# EAGLE design vhf-radio (EAGLE 6.3)
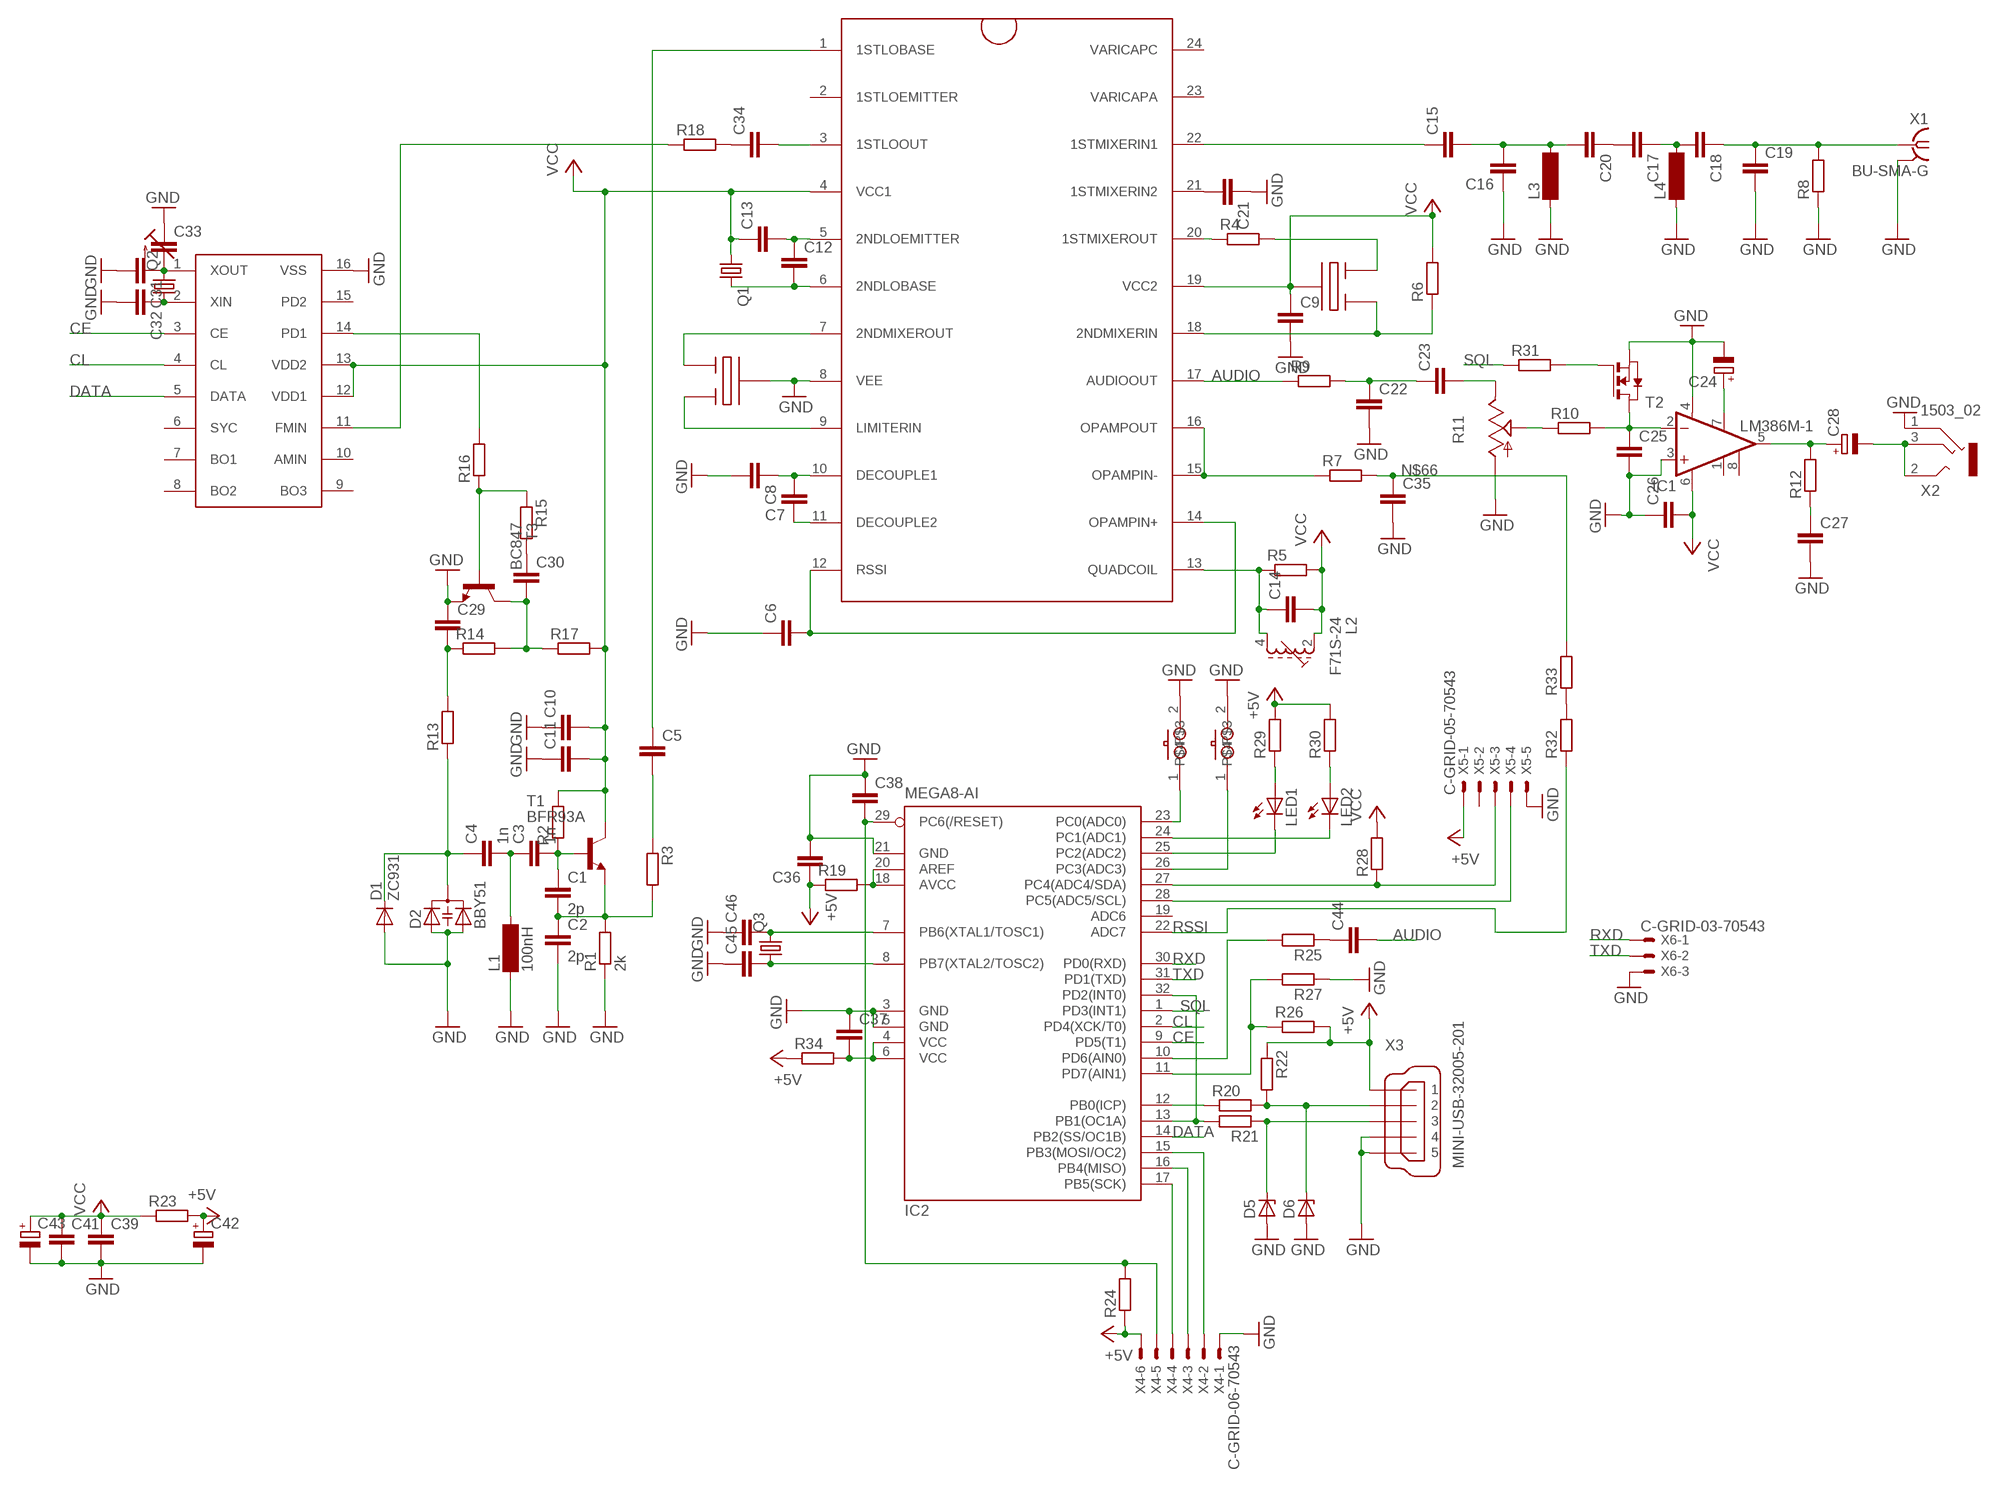
[diagram p0: schematic, sheet 1]

## Parts
C1  2p  C-EUC0805  [C0805]
C2  2p  C-EUC0805  [C0805]
C3  1n  C-EUC0805  [C0805]
C4  1n  C-EUC0805  [C0805]
C5  C-EUC0805  [C0805]
C6  C-EUC0805  [C0805]
C7  C-EUC0805  [C0805]
C8  C-EUC0805  [C0805]
C9  C-EUC0805  [C0805]
C10  C-EUC0805  [C0805]
C11  C-EUC0805  [C0805]
C12  C-EUC0805  [C0805]
C13  C-EUC0805  [C0805]
C14  C-EUC0805  [C0805]
C15  C-EUC0805  [C0805]
C16  C-EUC0805  [C0805]
C17  C-EUC0805  [C0805]
C18  C-EUC0805  [C0805]
C19  C-EUC0805  [C0805]
C20  C-EUC0805  [C0805]
C21  C-EUC0805  [C0805]
C22  C-EUC0805  [C0805]
C23  C-EUC0805  [C0805]
C24  CPOL-EU153CLV-0505  [153CLV-0505]
C25  C-EUC0805  [C0805]
C26  C-EUC0805  [C0805]
C27  C-EUC0805  [C0805]
C28  CPOL-EU153CLV-0605  [153CLV-0605]
C29  C-EUC0805  [C0805]
C30  C-EUC0805  [C0805]
C31  C-EUC0805  [C0805]
C32  C-EUC0805  [C0805]
C33  C-TRIMM3018_12  [CTRIM3018_12]
C34  C-EUC0805  [C0805]
C35  C-EUC0805  [C0805]
C36  C-EUC0805  [C0805]
C37  C-EUC0805  [C0805]
C38  C-EU075-032X103  [C075-032X103]
C39  C-EUC0805  [C0805]
C41  C-EUC0805  [C0805]
C42  CPOL-EU175TMP-0808  [175TMP-0808]
C43  CPOL-EU175TMP-0808  [175TMP-0808]
C44  C-EUC0805  [C0805]
C45  C-EUC0805  [C0805]
C46  C-EUC0805  [C0805]
D1  ZC931  DIODE-MINIMELF  [MINIMELF]
D2  BBY51  [SOT23]
D5  ZENER-DIODESOD80C  [SOD80C]
D6  ZENER-DIODESOD80C  [SOD80C]
IC1  LM386M-1  [SO08]
IC2  MEGA8-AI  [TQFP32-08]
L1  100nH  SM-1206  [SM-1206]
L2  F71S-24  [71S]
L3  SM-1206  [SM-1206]
L4  SM-1206  [SM-1206]
LED1  LEDCHIPLED_0805  [CHIPLED_0805]
LED2  LEDCHIPLED_0805  [CHIPLED_0805]
Q1  CRYSTALHC49UP  [HC49UP]
Q2  CRYSTALHC49UP  [HC49UP]
Q3  CRYSTALHC49UP  [HC49UP]
R1  2k  R-EU_R0805  [R0805]
R2  R-EU_R0805  [R0805]
R3  R-EU_R0805  [R0805]
R4  R-EU_R0805  [R0805]
R5  R-EU_R0805  [R0805]
R6  R-EU_R0805  [R0805]
R7  R-EU_R0805  [R0805]
R8  R-EU_R0805  [R0805]
R9  R-EU_R0805  [R0805]
R10  R-EU_R0805  [R0805]
R11  TRIM_US-CIP20C-6MM  [CIP20C-6MM]
R12  R-EU_R0805  [R0805]
R13  R-EU_R0805  [R0805]
R14  R-EU_R0805  [R0805]
R15  R-EU_R0805  [R0805]
R16  R-EU_R0805  [R0805]
R17  R-EU_R0805  [R0805]
R18  R-EU_R0805  [R0805]
R19  R-EU_R0805  [R0805]
R20  R-EU_R0805  [R0805]
R21  R-EU_R0805  [R0805]
R22  R-EU_R0805  [R0805]
R23  R-EU_0207/10  [0207/10]
R24  R-EU_R0805  [R0805]
R25  R-EU_R0805  [R0805]
R26  R-EU_R0805  [R0805]
R27  R-EU_R0805  [R0805]
R28  R-EU_0207/10  [0207/10]
R29  R-EU_R0805  [R0805]
R30  R-EU_R0805  [R0805]
R31  R-EU_R1206  [R1206]
R32  R-EU_0207/10  [0207/10]
R33  R-EU_0207/10  [0207/10]
R34  R-EU_0207/10  [0207/10]
T1  BFR93A  BFR53-NPN-SOT23-BEC  [SOT23-BEC]
T2  NMOSSOT23  [SOT-23]
T3  BC847  [SOT23]
U$1  MC13135P-SMD  [DIP-SMD]
U$2  QFILTER  [SIP3-SMD]
U$3  QFILTER  [SIP3-SMD]
U$4  LM7001-DIPSMD  [DIP16-SMD]
U$5  TS-1  [TS-1]
U$6  TS-1  [TS-1]
X1  BU-SMA-G  [BU-SMA-G]
X2  1503_02  [1503_02]
X3  MINI-USB-32005-201  [32005-201]
X4  C-GRID-06-70543  [70543-06]
X5  C-GRID-05-70543  [70543-05]
X6  C-GRID-03-70543  [70543-03]

## Nets
+5V: C36.1 C42.+ R19.1 R22.1 R23.2 R24.1 R26.2 R29.2 R30.2 R34.1 X3.1 X4.6 X5.1
AUDIO: C44.2 R9.1 U$1.17(AUDIOOUT)
CE: IC2.9(PD5(T1)) U$4.3(CE)
CL: IC2.2(PD4(XCK/T0)) U$4.4(CL)
DATA: IC2.14(PB2(SS/OC1B)) U$4.5(DATA)
GND: C2.2 C6.1 C8.2 C9.2 C10.1 C11.1 C16.1 C19.2 C21.1 C22.2 C24.- C25.2 C26.1 C27.2 C29.1 C31.2 C32.2 C33.+(E) C35.2 C36.2 C37.1 C38.1 C39.2 C41.2 C42.- C43.- C45.1 C46.1 D1.A D2.1(A1) D2.2(A2) D5.A D6.A IC1.3(+IN) IC1.4(GND) IC2.3(GND) IC2.5(GND) IC2.21(GND) L1.1 L3.1 L4.1 R1.1 R8.1 R11.A R27.1 T2.2(S) T3.2(E) U$1.8(VEE) U$2.P$2 U$4.16(VSS) U$5.2 U$6.2 X1.2(GND) X2.1 X3.4 X3.5 X4.1 X5.5 X6.3
N$1: C1.2 C2.1 R1.2 R3.2 T1.E
N$2: C1.1 C3.2 R2.1 T1.B
N$3: C5.2 R3.1
N$4: C3.1 C4.2 L1.2
N$5: R16.2 U$4.14(PD1)
N$6: C5.1 U$1.1(1STLOBASE)
N$7: C6.2 U$1.12(RSSI) U$1.14(OPAMPIN+)
N$8: U$1.7(2NDMIXEROUT) U$2.P$1
N$9: U$1.9(LIMITERIN) U$2.P$3
N$10: C14.1 L2.4(E) R5.1 U$1.13(QUADCOIL)
N$11: C12.2 Q1.2 U$1.6(2NDLOBASE)
N$12: R4.1 U$1.20(1STMIXEROUT)
N$13: R4.2 U$3.P$3
N$14: R6.1 U$1.18(2NDMIXERIN) U$3.P$1
N$15: C12.1 C13.2 U$1.5(2NDLOEMITTER)
N$16: C15.2 C16.2 C20.2 L3.2
N$17: C7.1 U$1.11(DECOUPLE2)
N$18: C7.2 C8.1 U$1.10(DECOUPLE1)
N$19: R7.1 U$1.15(OPAMPIN-) U$1.16(OPAMPOUT)
N$20: C21.2 U$1.21(1STMIXERIN2)
N$21: C15.1 U$1.22(1STMIXERIN1)
N$22: C45.2 IC2.8(PB7(XTAL2/TOSC2)) Q3.1
N$23: C17.2 C20.1
N$24: C17.1 C18.2 L4.2
N$25: C18.1 C19.1 R8.2 X1.1
N$26: C22.1 C23.1 R9.2
N$27: C23.2 R11.E
N$28: R10.1 R11.S
N$29: C25.1 IC1.2(-IN) R10.2 T2.1(D)
N$30: C24.+ IC1.7(BYPASS)
N$31: C29.2 R13.2 R14.1
N$32: C27.1 R12.1
N$33: C28.+ IC1.5(OUT) R12.2
N$34: C28.- X2.2 X2.3
N$35: C30.2 R14.2 R17.1 T3.3(C)
N$36: R15.1 R16.1 T3.1(B)
N$37: C30.1 R15.2
N$38: C31.1 C33.-(A) Q2.2 U$4.1(XOUT)
N$39: IC2.18(AVCC) IC2.20(AREF) R19.2
N$40: C32.1 Q2.1 U$4.2(XIN)
N$41: C34.1 R18.2
N$42: C34.2 U$1.3(1STLOOUT)
N$43: R18.1 U$4.11(FMIN)
N$44: C4.1 D1.C D2.3(C) R13.1
N$45: IC2.13(PB1(OC1A)) IC2.32(PD2(INT0)) R21.2
N$46: IC2.12(PB0(ICP)) R20.1
N$47: D6.C R20.2 R22.2 X3.2
N$48: D5.C R21.1 X3.3
N$49: IC2.15(PB3(MOSI/OC2)) X4.2
N$50: IC2.16(PB4(MISO)) X4.3
N$51: IC2.17(PB5(SCK)) X4.4
N$52: C38.2 IC2.29(PC6(/RESET)) R24.2 X4.5
N$53: C44.1 R25.1
N$54: IC2.10(PD6(AIN0)) R25.2
N$55: IC2.11(PD7(AIN1)) R26.1 R27.2
N$56: C46.2 IC2.7(PB6(XTAL1/TOSC1)) Q3.2
N$57: IC2.27(PC4(ADC4/SDA)) R28.1 X5.3
N$58: IC2.28(PC5(ADC5/SCL)) X5.4
N$59: IC2.25(PC2(ADC2)) LED1.C
N$60: IC2.24(PC1(ADC1)) LED2.C
N$61: LED1.A R29.1
N$62: LED2.A R30.1
N$63: IC2.23(PC0(ADC0)) U$5.1
N$64: IC2.26(PC3(ADC3)) U$6.1
N$65: R31.2 T2.3(G)
N$66: C35.1 R7.2 R33.2
N$67: R32.2 R33.1
N$68: C37.2 IC2.4(VCC) IC2.6(VCC) R34.2
RSSI: IC2.22(ADC7) R32.1
RXD: IC2.30(PD0(RXD)) X6.1
SQL: IC2.1(PD3(INT1)) R31.1
TXD: IC2.31(PD1(TXD)) X6.2
VCC: C9.1 C10.2 C11.2 C13.1 C14.2 C26.2 C39.1 C41.1 C43.+ IC1.6(VS) L2.2(A) Q1.1 R2.2 R5.2 R6.2 R17.2 R23.1 R28.2 T1.C U$1.4(VCC1) U$1.19(VCC2) U$3.P$2 U$4.12(VDD1) U$4.13(VDD2)
Unconnected: IC1.1(GAIN) IC1.8(GAIN) IC2.19(ADC6) L2.S1 L2.S2 U$1.2(1STLOEMITTER) U$1.23(VARICAPA) U$1.24(VARICAPC) U$4.6(SYC) U$4.7(BO1) U$4.8(BO2) U$4.9(BO3) U$4.10(AMIN) U$4.15(PD2) X2.2@2 X5.2

## Power pins joined to a net without a drawn wire
GND: X1.3(GND) X1.4(GND) X1.5(GND)

## Library data of the parts
C1-C4 C12 C13 C15-C23 = resistor:C-EU: CAPACITOR, European symbol
C5-C11 C14 C25-C27 C29-C32 C34-C39 C41 C44-C46 = rcl:C-EU: CAPACITOR, European symbol
C24 C42 C43 = rcl:CPOL-EU: POLARIZED CAPACITOR, European symbol
C28 = resistor:CPOL-EU: POLARIZED CAPACITOR, European symbol
C33 = rcl:C-TRIMM: Trimm capacitor
D1 = diode:DIODE-: DIODE
D2 = diode:BBY51: Capacity DIODE variable-capacitance diode (Infineon)
D5 D6 = diode:ZENER-DIODE: Z-Diode
IC1 = linear:LM386?-*: Low Voltage Audio Power Amplifier Source: http://cache.national.com/ds/LM/LM386.pdf
IC2 = atmel:MEGA8: MICROCONTROLLER 8 Kbytes FLASH, 1 kbytes SRAM, 512 bytes EEPROM, USART, 6-channel 10 bit ADC, 2-channel 8 bit ADC Pin compatible with Atmega48, ATMega88, ATMega168 Source: avr.lbr
L1 L3 L4 = inductor-neosid:SM-1206: INDUCTOR SMD chip inductor
L2 = inductor-neosid:F71S-: FILTER pre-adjusted filter coil, type S
LED1 LED2 = led:LED: LED OSRAM: - CHIPLED LG R971, LG N971, LY N971, LG Q971, LY Q971, LO R971, LY R971 LH N974, LH R974 LS Q976, LO Q976, LY Q976 LO Q996 - Hyper CHIPLED LW Q18S LB Q993, LB Q99A, LB R99A - SideLED LS A670, LO A670, LY A670, LG A670, LP A670 LB A673, LV A673, LT A673, LW A673 LH A674 LY A675 LS A676, LA A676, LO A676, LY A676, LW A676 LS A679, LY A679, LG A679 - Hyper Micro SIDELED® LS Y876, LA Y876, LO Y876, LY Y876 LT Y87S - SmartLED LW L88C, LW L88S LB L89C, LB L89S, LG L890 LS L89K, LO L89K, LY L89K LS L896, LA L896, LO L896, LY L896 - TOPLED LS T670, LO T670, LY T670, LG T670, LP T670 LSG T670, LSP T670, LSY T670, LOP T670, LYG T670 LG T671, LOG T671, LSG T671 LB T673, LV T673, LT T673, LW T673 LH T674 LS T676, LA T676, LO T676, LY T676, LB T676, LH T676, LSB T676, LW T676 LB T67C, LV T67C, LT T67C, LS T67K, LO T67K, LY T67K, LW E67C LS E67B, LA E67B, LO E67B, LY E67B, LB E67C, LV E67C, LT E67C LW T67C LS T679, LY T679, LG T679 LS T770, LO T770, LY T770, LG T770, LP T770 LB T773, LV T773, LT T773, LW T773 LH T774 LS E675, LA E675, LY E675, LS T675 LS T776, LA T776, LO T776, LY T776, LB T776 LHGB T686 LT T68C, LB T68C - Hyper Mini TOPLED® LB M676 - Mini TOPLED Santana® LG M470 LS M47K, LO M47K, LY M47K Source: http://www.osram.convergy.de LUXEON: - LUMILED® LXK2-PW12-R00, LXK2-PW12-S00, LXK2-PW14-U00, LXK2-PW14-V00 LXK2-PM12-R00, LXK2-PM12-S00, LXK2-PM14-U00 LXK2-PE12-Q00, LXK2-PE12-R00, LXK2-PE12-S00, LXK2-PE14-T00, LXK2-PE14-U00 LXK2-PB12-K00, LXK2-PB12-L00, LXK2-PB12-M00, LXK2-PB14-N00, LXK2-PB14-P00, LXK2-PB14-Q00 LXK2-PR12-L00, LXK2-PR12-M00, LXK2-PR14-Q00, LXK2-PR14-R00 LXK2-PD12-Q00, LXK2-PD12-R00, LXK2-PD12-S00 LXK2-PH12-R00, LXK2-PH12-S00 LXK2-PL12-P00, LXK2-PL12-Q00, LXK2-PL12-R00 Source: www.luxeon.com KINGBRIGHT: KA-3528ASYC Source: www.kingbright.com
Q1-Q3 = crystal:CRYSTAL: CRYSTAL
R1 R2 R8 R23 R28 R32-R34 = resistor:R-EU_: RESISTOR, European symbol
R3-R7 R9 R10 R12-R22 R24-R27 R29-R31 = rcl:R-EU_: RESISTOR, European symbol
R11 = pot:TRIM_US-: POTENTIOMETER
T1 = transistor:*-NPN-: NPN Transistror BF959 corrected 2008.03.06
T2 = zetex:NMOSSOT23: MOS FET
T3 = transistor:BC847: NPN TRANSISTOR
U$1 = radio:MC13135P-SMD
U$2 U$3 = radio:QFILTER
U$4 = radio:LM7001-DIPSMD
U$5 U$6 = radio:TS-1
X1 = con-coax:BU-SMA-G: FEMALE SMA CONNECTOR Radiall distributor RS 193-9117
X2 = con-lumberg:1503_02: Jack connectors according to JISC 6560, 3.5 mm Klinkeneinbaukupplung nach JISC 6560, 3,5 mm, 3-polig/stereo, abgewinkelte Ausführung, Surface-Mount-Technik (SMT) Source: http://www.lumberg.com/Produkte/PDFs/1503_02.pdf
X3 = con-cypressindustries:MINI-USB-: MINI USB-B Conector Source: www.cypressindustries.com
X4 = con-molex:C-GRID-06: CONNECTOR wire to board 2.54 mm (0.100") pitch header
X5 = con-molex:C-GRID-05: CONNECTOR wire to board 2.54 mm (0.100") pitch header
X6 = con-molex:C-GRID-03: CONNECTOR wire to board 2.54 mm (0.100") pitch header

## Board
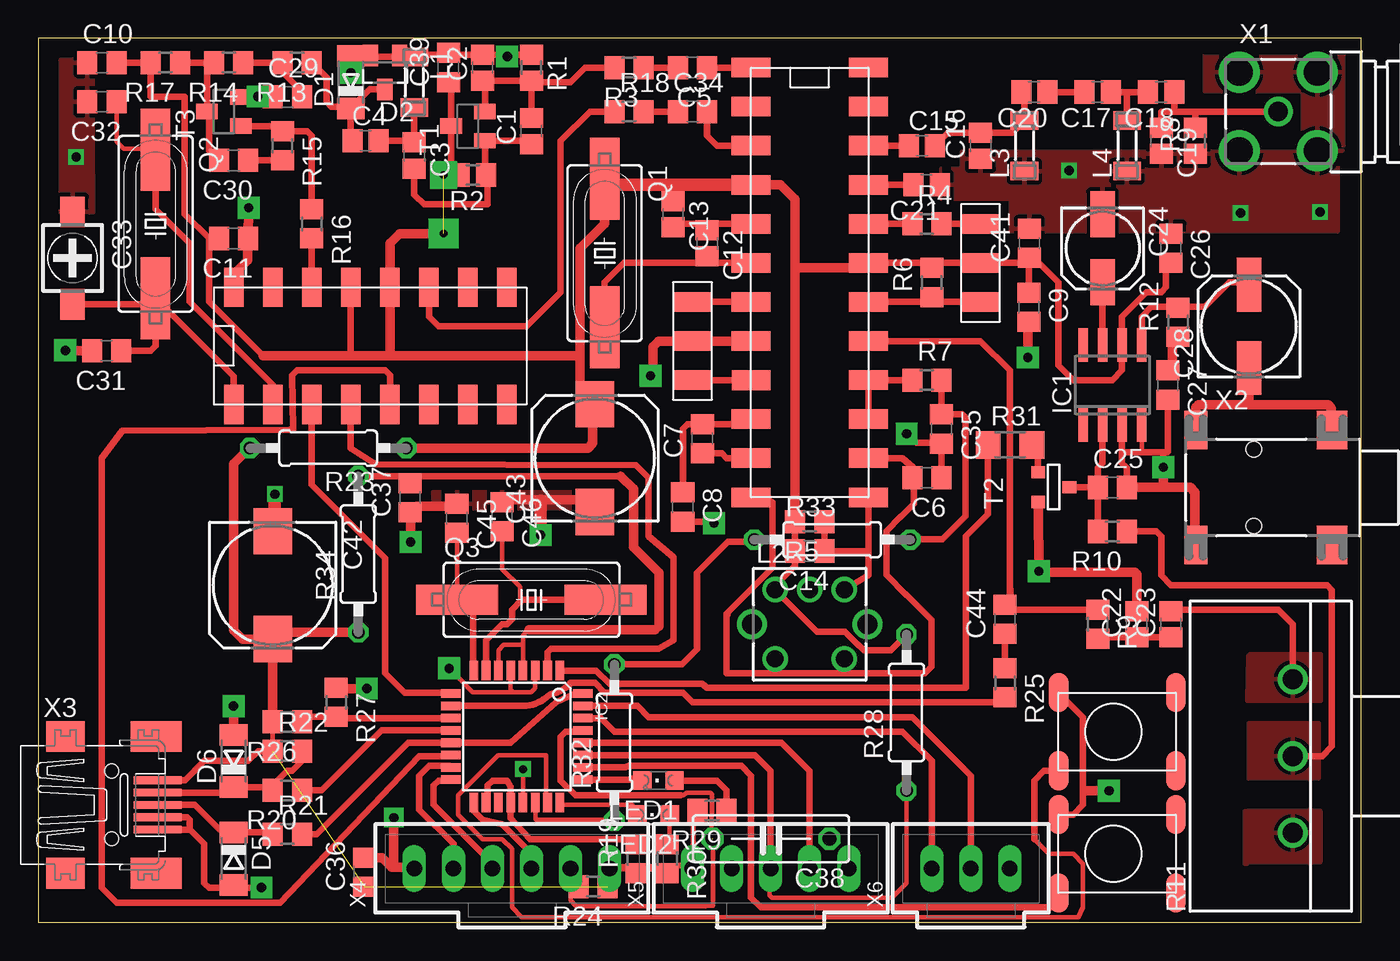
[diagram p1: board, top side]
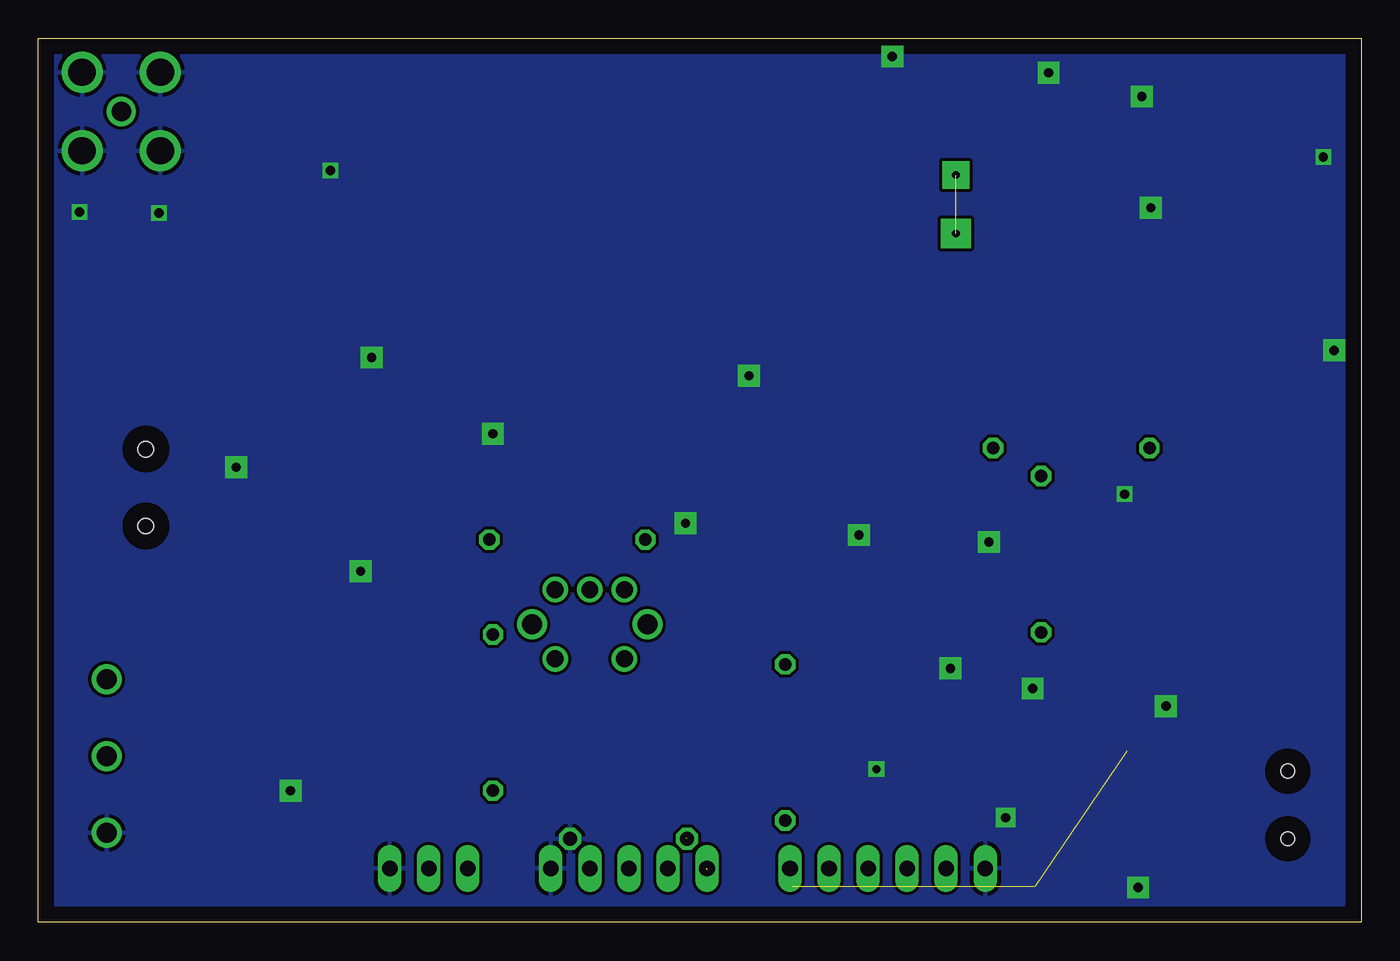
[diagram p2: board, bottom side, seen from below]

Size 86.03 x 57.46 mm. Coordinates in mm from the lower left corner, seen from the top.
Outline: 0,0 86.03,0 86.03,57.46 0,57.46 0,0
Copper layers (1*16): Top 0.035mm / dielectric 1.5mm / Bottom 0.035mm
Design rules "default": minimum track width 10mil, minimum drill 24mil, track to track 8mil, track to pad 8mil, pad to pad 8mil, via to via 8mil, smd to smd 8mil, copper to edge 40mil, drill to drill 8mil, minimum pad ring 10mil, minimum via ring 8mil, stop-mask expansion 4mil, vias tented up to drill 0mil, thermal gap 10mil

### Footprints (pad centres in the part's own frame; a part is rotated, then mirrored left to right if it is on the bottom)
C0805 = smd 1.3 x 1.5: 1 -0.85,0; 2 0.85,0
C0805' = smd 1.3 x 1.5: 1 -0.95,0; 2 0.95,0
153CLV-0505 = smd 3 x 1.6: + 2.2,0; - -2.2,0
153CLV-0605 = smd 3.5 x 1.6: + 2.7,0; - -2.7,0
CTRIM3018_12 = smd 2 x 1.6: + -3,0; - 3,0
C075-032X103 = drill 0.914 octagon: 1 -3.81,0; 2 3.81,0
175TMP-0808 = smd 3 x 2.5: + 3.5,0; - -3.5,0
MINIMELF = smd 1.4 x 1.8: A 1.7,0; C -1.7,0
SOT23 = smd 1 x 1.4: 1 -0.95,-1.1; 2 0.95,-1.1; 3 0,1.1
SOD80C = smd 1.4 x 1.8: A 1.7,0; C -1.7,0
SO08 = smd 0.6 x 2.2: 1 -1.905,-2.6; 2 -0.635,-2.6; 3 0.635,-2.6; 4 1.905,-2.6; 5 1.905,2.6; 6 0.635,2.6; 7 -0.635,2.6; 8 -1.905,2.6
TQFP32-08 = smd 1.27 x 0.559: 1 -4.293,2.8; 2 -4.293,2; 3 -4.293,1.2; 4 -4.293,0.4; 5 -4.293,-0.4; 6 -4.293,-1.2; 7 -4.293,-2; 8 -4.293,-2.8; 17 4.293,-2.8; 18 4.293,-2; 19 4.293,-1.2; 20 4.293,-0.4; 21 4.293,0.4; 22 4.293,1.2; 23 4.293,2; 24 4.293,2.8 | smd 0.559 x 1.27: 9 -2.8,-4.293; 10 -2,-4.293; 11 -1.2,-4.293; 12 -0.4,-4.293; 13 0.4,-4.293; 14 1.2,-4.293; 15 2,-4.293; 16 2.8,-4.293; 25 2.8,4.293; 26 2,4.293; 27 1.2,4.293; 28 0.4,4.293; 29 -0.4,4.293; 30 -1.2,4.293; 31 -2,4.293; 32 -2.8,4.293
SM-1206 = smd 1.2 x 1.8: 1 -1.65,0; 2 1.65,0
71S = drill 1.1: 1 -2.25,-2.25; 2 -2.25,2.25; 3 0,2.25; 4 2.25,2.25; 5 2.25,-2.25 | drill 1.3: S1 -3.75,0; S2 3.75,0
CHIPLED_0805 = smd 1.2 x 1.2: A 0,-1.05; C 0,1.05
HC49UP = smd 5.334 x 1.93: 1 -4.826,0; 2 4.826,0
R0805 = smd 1.3 x 1.5: 1 -0.85,0; 2 0.85,0
R0805' = smd 1.3 x 1.5: 1 -0.95,0; 2 0.95,0
CIP20C-6MM = drill 1.3 pad 1.93: A -5,0; E 5,0; S 0,0
0207/10 = drill 0.813 octagon: 1 -5.08,0; 2 5.08,0
R1206 = smd 1.6 x 1.803: 1 -1.422,0; 2 1.422,0
SOT23-BEC = smd 1 x 1.4: B -0.95,-1.1; C 0,1.1; E 0.95,-1.1
SOT-23 = smd 0.787 x 0.889: 1 0.025,-1.016; 2 -0.94,1.016; 3 0.991,1.016
DIP-SMD = smd 2.54 x 1.27: 1 0,0; 2 0,-2.54; 3 0,-5.08; 4 0,-7.62; 5 0,-10.16; 6 0,-12.7; 7 0,-15.24; 8 0,-17.78; 9 0,-20.32; 10 0,-22.86; 11 0,-25.4; 12 0,-27.94; 13 7.62,-27.94; 14 7.62,-25.4; 15 7.62,-22.86; 16 7.62,-20.32; 17 7.62,-17.78; 18 7.62,-15.24; 19 7.62,-12.7; 20 7.62,-10.16; 21 7.62,-7.62; 22 7.62,-5.08; 23 7.62,-2.54; 24 7.62,0
SIP3-SMD = smd 2.54 x 1.27: P$1 0,1.27; P$2 0,-1.27; P$3 0,-3.81
DIP16-SMD = smd 2.54 x 1.27: 1 0,0; 2 0,-2.54; 3 0,-5.08; 4 0,-7.62; 5 0,-10.16; 6 0,-12.7; 7 0,-15.24; 8 0,-17.78; 9 7.62,-17.78; 10 7.62,-15.24; 11 7.62,-12.7; 12 7.62,-10.16; 13 7.62,-7.62; 14 7.62,-5.08; 15 7.62,-2.54; 16 7.62,0
TS-1 = smd 2.54 x 1.27: 1 0,0; 2 5.08,0; 3 0,-7.62; 4 5.08,-7.62
BU-SMA-G = drill 1.27: 1 0,0 | drill 1.778: 2 -2.55,2.55; 3 2.55,2.55; 4 2.55,-2.55; 5 -2.55,-2.55
1503_02 = smd 2.5 x 1.5: 1 3.75,-10.75; 3 -3.75,-10.75 | smd 2.5 x 2: 2 -3.75,-1.9; 2@2 3.75,-1.9 | hole 1: -2.5,-7; 2.5,-7
32005-201 = smd 3.1 x 0.5: 1 3,1.6; 2 3,0.8; 3 3,0; 4 3,-0.8; 5 3,-1.6 | smd 2.5 x 2: M1 -3,-4.45; M2 -3,4.45 | smd 3.3 x 2: M3 2.9,4.45; M4 2.9,-4.45 | hole 0.9: 0,2.2; 0,-2.2
70543-06 = drill 1.016 long: 1 -6.35,0; 2 -3.81,0; 3 -1.27,0; 4 1.27,0; 5 3.81,0; 6 6.35,0
70543-05 = drill 1.016 long: 1 -5.08,0; 2 -2.54,0; 3 0,0; 4 2.54,0; 5 5.08,0
70543-03 = drill 1.016 long: 1 -2.54,0; 2 0,0; 3 2.54,0

### Placement (x,y rotation side)
C1  32.07,51.44 90 top
C2  28.89,55.56 90 top
C3  24.45,49.85 270 top
C4  21.27,50.8 0 top
C5  [C0805']  42.55,55.56 180 top
C6  [C0805']  57.78,28.89 180 top
C7  [C0805']  43.18,31.43 90 top
C8  [C0805']  41.91,26.99 270 top
C9  [C0805']  64.43,39.98 270 top
C10  [C0805']  4.13,55.88 0 top
C11  [C0805']  12.7,44.45 180 top
C12  43.5,44.13 270 top
C13  41.27,46.04 270 top
C14  [C0805']  50.17,24.13 180 top
C15  57.47,50.48 0 top
C16  61.28,50.48 90 top
C17  68.9,53.97 180 top
C18  73.03,53.97 180 top
C19  73.03,50.8 270 top
C20  64.77,53.97 180 top
C21  57.77,47.94 180 top
C22  71.44,19.37 90 top
C23  73.66,19.37 90 top
C24  69.22,43.81 270 top
C25  [C0805']  69.85,28.26 0 top
C26  [C0805']  73.66,43.81 270 top
C27  [C0805']  73.46,34.92 270 top
C28  78.74,38.73 90 top
C29  [C0805']  16.19,53.66 0 top
C30  [C0805']  12.7,49.53 180 top
C31  [C0805']  4.44,37.15 180 top
C32  [C0805']  4.13,53.34 180 top
C33  2.22,43.18 270 top
C34  [C0805']  42.55,52.7 0 top
C35  [C0805']  58.74,32.07 270 top
C36  [C0805']  21.21,3.25 90 top
C37  [C0805']  24.18,27.6 90 top
C38  47.65,5.42 180 top
C39  [C0805']  26.67,55.56 90 top
C41  [C0805']  64.45,44.13 90 top
C42  15.24,21.91 270 top
C43  36.2,30.16 90 top
C44  [C0805']  62.86,19.68 90 top
C45  [C0805']  27.22,26.26 270 top
C46  [C0805']  30.16,26.35 270 top
D1  20.32,54.61 90 top
D2  22.54,55.24 180 top
D5  12.7,4.13 270 top
D6  12.7,10.48 90 top
IC1  69.85,34.92 0 top
IC2  31.12,12.07 270 top
L1  24.45,54.61 270 top
L2  50.17,19.37 0 top
L3  64.14,50.48 90 top
L4  70.8,50.48 90 top
LED1  40.32,9.21 90 top
LED2  40.01,6.98 90 top
Q1  36.83,43.5 270 top
Q2  7.62,45.4 270 top
Q3  32.07,20.96 0 top
R1  32.07,55.56 270 top
R2  28.26,48.58 180 top
R3  [R0805']  38.42,55.56 180 top
R4  [R0805']  57.78,45.4 0 top
R5  [R0805']  50.17,26.04 180 top
R6  [R0805']  58.1,41.59 90 top
R7  [R0805']  57.78,35.24 0 top
R8  75.25,50.8 90 top
R9  [R0805']  68.9,19.37 270 top
R10  [R0805']  69.85,25.4 180 top
R11  81.6,10.79 90 top
R12  [R0805']  74.12,39 90 top
R13  [R0805']  16.83,55.88 180 top
R14  [R0805']  12.38,55.88 180 top
R15  [R0805']  15.87,50.48 270 top
R16  [R0805']  17.78,45.4 270 top
R17  [R0805']  8.26,55.88 180 top
R18  [R0805']  38.42,52.7 0 top
R19  [R0805']  38.95,4.13 90 top
R20  [R0805']  16.19,8.57 180 top
R21  [R0805']  16.19,5.71 0 top
R22  [R0805']  16.19,11.11 0 top
R23  18.85,30.82 180 top
R24  [R0805']  36.08,2.31 180 top
R25  [R0805']  62.86,15.56 270 top
R26  [R0805']  16.19,13.02 180 top
R27  [R0805']  19.37,14.29 270 top
R28  56.46,13.63 90 top
R29  [R0805']  43.81,7.26 180 top
R30  [R0805']  40.89,4.13 270 top
R31  63.2,31.03 0 top
R32  37.47,11.68 90 top
R33  51.63,24.87 0 top
R34  20.8,23.93 90 top
T1  27.94,51.75 90 top
T2  66.04,28.26 90 top
T3  12.06,52.7 90 top
U$1  46.36,55.56 0 top
U$2  42.55,39.05 0 top
U$3  61.28,41.59 180 top
U$4  12.7,33.66 90 top
U$5  66.36,9.84 90 top
U$6  66.36,1.91 90 top
X1  80.64,52.7 0 top
X2  86.04,28.26 270 top
X3  4.76,7.62 0 top
X4  30.8,3.49 0 top
X5  47.62,3.49 0 top
X6  60.64,3.49 0 top

### Tracks (layer width: path | path; a pad name or v marks a point on that pad's centre or on a via)
+5V  (3 unrouted)
  Top 0.305: 40.96,3.49 R30.2 | R24.1 37.03,3.38 X4.6 37.15,3.57 37.08,3.63 42.69,3.63 42.57,6.86 42.54,3.41 42.77,3.73 41.61,3.73 41.44,3.57 41.29,3.57 41.02,3.3 | 15.68,18.85 C42.+ 15.21,18.38 | R22.1 R26.2 | 13.72,30.82 R23.2
  Top 0.406: X3.1 9.54,9.22 10.79,10.48 13.65,10.48 14.29,11.11 R22.1 | X4.6 39.05,3.49 | 39.05,3.49 40.96,3.49 | 39.05,3.49 R19.1 | 42.57,6.86 R29.2
  Top 0.61: 15.68,18.85 R34.1 | R26.2 C42.+ | 13.72,30.82 12.69,29.79 12.69,18.99 13.3,18.38 15.21,18.38
AUDIO
  Top 0.305: 63.21,20.31 63.19,20.31 C44.2
  Top 0.406: U$1.17 61.28,37.78 63.18,35.88 63.18,23.18 63.21,20.31 68.92,20.31 R9.1 | C44.2 63.18,20.32 63.18,24.13
CE
  Top 0.406: U$4.3 17.78,28.42 22.54,23.66 22.54,16.19 23.81,14.92 26.77,14.92 IC2.9
CL
  Top 0.406: IC2.2 33.12,17.56 33.34,17.78 40.32,17.78 41.31,18.31 41.31,23.71 39.69,25.08 39.69,28.89 38.88,29.72 21.95,29.76 20.32,30.8 U$4.4
DATA
  Top 0.406: U$4.5 22.86,35.56 22.54,35.88 16.83,35.88 16.51,35.56 16.56,32.04 16.37,32 5.45,31.95 4.13,30.16 4.13,2.22 5.08,1.27 15.71,1.26 24.77,10.79 26.75,10.79 IC2.14
GND  (via drill 0.5 pad 1.02, 0.6, 0.6 pad 1.27, 0.6 pad 1.42)
  Top 0.305: 1.78,37.15 v1.75,37.17 | v13.67,46.45 v13.68,46.46 | U$4.16 12.7,42.11 | 13.61,44.41 C11.1 | v14.26,53.68 15.22,53.68 C29.1 | 20.37,56.26 21.51,56.26 D2.2 | D2.1 24.36,56.35 L1.1 | 24.6,56.41 26.57,56.41 C39.2 | C43.- 36.2,26.91 35.65,27.46 | C46.1 30.32,27.46 | 32.72,27.46 32.66,27.41 | C37.1 24.23,26.67 24.59,27.03 | 27.03,27.03 C45.1 | D5.A 12.88,2.25 | D6.A 12.69,12.19 | R27.1 19.42,15.19 | 24.21,26.38 24.3,26.47 24.3,26.52 | C42.- 15.38,25.55 | 43.84,26.04 v43.94,25.93 | v39.81,35.52 39.81,35.65 39.97,35.8 | C6.1 | 56.5,31.75 v56.48,31.75 | C35.2 58.7,31.15 | 67.95,8.47 68.02,8.55 | 65.05,26.87 T2.2 | X2.1 75.22,24.58 | 73.19,28.26 73.17,28.29 | IC1.4 71.77,30.56 71.79,30.56 | 73.42,30.56 73.46,30.59 | 70.48,30.57 70.55,30.56 | 71.32,22.75 71.44,22.63 | 83.38,46.18 v83.36,46.18 v83.35,46.18 83.34,46.19 83.35,46.19 83.38,46.22 | 64.36,38.97 C9.2 | IC2.3 32.31,15.22 32.03,14.94 30.89,14.94 | 30.89,14.94 30.71,15.11 IC2.5 | 30.89,14.94 28.25,14.94 26.73,16.5 v26.71,16.5 | IC2.21 31.52,9.09 v31.52,9.94 | 24.36,3.58 X4.1
  Top 0.406: IC1.3 70.48,30.57 70.48,29.85 70.8,29.53 C25.2 | T3.2 C29.1 | R1.1 C2.2 24.6,56.41 L1.1 20.37,56.26 D1.A | X3.5 9.83,6.02 9.84,6.03 | 9.84,6.03 10.79,5.08 10.79,2.54 11.11,2.22 12.49,2.22 D5.A | X3.4 9.69,6.82 9.84,6.67 9.84,6.03 | U$5.2 67.95,13.33 67.95,8.47 67.95,7.62 67.31,6.98 U$6.2 | 12.88,2.25 v14.5,2.25 | C8.2 43.84,26.04 | C6.1 C35.2 | 56.5,31.75 57.1,31.15 58.7,31.15 | 73.46,30.59 C27.2 | 71.79,30.56 73.42,30.56 | 70.55,30.56 71.77,30.56 | 73.17,29.57 73.17,30.54
  Top 0.61: U$1.8 U$2.P$2 40.32,37.78 39.97,37.43 39.97,35.8 | C31.2 1.78,37.15 | C11.1 v13.67,46.45 | 12.7,42.11 13.61,43.03 13.61,44.41 | v20.32,55.22 D1.A | 30.32,27.46 32.72,27.46 35.65,27.46 | 24.59,27.03 27.03,27.03 | 12.69,12.19 v12.69,14.05 | 19.42,15.19 v21.36,15.19 | v24.21,24.71 24.21,26.38 | 68.02,8.55 v69.63,8.55 | 65.05,26.87 v65.08,22.82 65.05,23.06 65.37,22.75 71.32,22.75 | C25.2 73.19,28.26 74.92,28.26 75.22,27.95 75.22,24.58 | 73.17,28.29 73.17,29.57 v73.17,29.58 | 71.44,22.63 C22.2 | v64.36,36.72 64.36,38.97 | C36.2 22.36,4.2 22.97,3.58 24.36,3.58
  Top 0.813: 32.66,27.41 v32.66,25.17 | 15.38,25.55 v15.38,27.83
  other vias: 2.45,49.75 30.49,56.29 67.04,48.87 78.19,46.11 23.11,6.79
  pour Bottom: -0.51,57.82 86.54,57.82 86.54,53.16 86.54,-0.44 -0.36,-0.44 -0.36,1.07 -0.36,11.28 -0.36,55.24 -0.36,57.81
  pour Top: 1.45,56.06 3.53,56.06 3.53,55.61 3.54,55.61 3.54,48.58 3.57,48.58 3.57,46.16 1.52,46.16 1.52,46.08 1.45,46.08 1.45,56.01
  pour Top: 35.17,27.88 37.35,27.88 37.35,26.92 23.53,26.92 23.53,27.17 25.74,27.17 25.67,27.94 34.91,27.94 34.99,27.93 35.01,27.93 35.01,27.9
  pour Top: 60.06,50.1 84.51,50.1 84.51,44.91 63.25,44.91 63.25,47.04 58.72,47.04 58.72,48.97 60.06,48.97 60.06,50.03
  pour Top: 75.87,56.11 75.87,54.01 82.23,54.01 82.23,50.15 84.82,50.15 84.82,50.44 84.87,50.44 84.87,56.49 75.96,56.49 75.96,56.55 75.88,56.55 75.88,56.13
  pour Top: 78.73,7.25 83.38,7.25 83.38,3.89 78.6,3.89 78.6,3.8 78.46,3.8 78.46,7.21 78.65,7.21 78.65,7.23
N$1
  Top 0.406: R3.2 35.56,55.56 34.61,54.61 32.17,54.61 R1.2 | R1.2 C2.1 29.04,54.57 T1.E | R1.2 C1.2
N$2
  Top 0.406: C1.1 31.85,50.8 T1.B 29.04,49.15 R2.1 29.21,48.58 29.21,46.67 25.08,46.67 24.45,47.31 C3.2
N$3
  Top 0.406: R3.1 C5.2
N$4
  Top 0.406: C4.2 24.34,50.8 C3.1 L1.2
N$5
  Top 0.406: U$4.14 R16.2
N$6
  Top 0.406: C5.1 U$1.1
N$7
  Top 0.305: C6.2 56.9,28.83 | U$1.12 47.43,27.62 47.75,27.3 | 57.61,16.19 57.67,16.19 | 56.46,21.3 56.44,21.3 | 56.08,26.37 56.1,26.37 | 56.93,28.79 C6.2 | C6.2 56.84,28.89 56.86,28.91 56.86,29.46 56.92,29.53
  Top 0.406: 44.77,20.07 44.77,16.19 57.61,16.19 | 44.77,20.07 44.82,19.98 | 56.92,29.53 56.2,30.16 U$1.14 | 47.75,27.3 47.75,23.05 44.77,20.07 | 57.67,16.19 58.09,16.61 58.09,19.67 56.46,21.3 | 56.44,21.3 55.14,22.59 55.14,25.43 56.08,26.37 | 56.1,26.37 56.93,27.2 56.93,28.79
N$8
  Top 0.406: U$2.P$1 U$1.7
N$9
  Top 0.406: U$2.P$3 U$1.9
N$10
  Top 0.406: 53.97,24.13 53.97,22.54 L2.4 | 53.97,24.13 U$1.13 | 53.97,24.13 C14.1 R5.1
N$11
  Top 0.305: C12.2 43.5,42.88 43.51,42.86
  Top 0.406: U$1.6 43.51,42.86 38.1,42.86 36.83,41.59 Q1.2
N$12
  Top 0.406: U$1.20 R4.1
N$13
  Top 0.406: R4.2 U$3.P$3
N$14
  Top 0.406: U$1.18 58.1,40.32 | 58.1,40.32 U$3.P$1 | 58.1,40.32 R6.1
N$15
  Top 0.406: 43.5,45.4 41.49,45.4 C13.2 | 43.5,45.4 U$1.5 | 43.5,45.4 C12.1
N$16
  Top 0.406: C20.2 64.14,53.76 L3.2 63.34,51.33 C16.2 59.17,51.33 C15.2
N$17
  Top 0.406: U$1.11 44.77,30.16 44.45,30.48 C7.1
N$18
  Top 0.406: U$1.10 45.4,32.7 45.09,32.39 C7.2 42.23,32.39 41.91,32.07 C8.1
N$19
  Top 0.406: U$1.15 U$1.16 R7.1
N$20
  Top 0.406: U$1.21 C21.2
N$21
  Top 0.406: U$1.22 C15.1
N$22
  Top 0.305: C45.2 27.22,20.98 Q3.1
  Top 0.406: IC2.8 28.26,16.42 28.26,20.96 Q3.1
N$23
  Top 0.406: C20.1 C17.2
N$24
  Top 0.406: 70.8,53.97 C17.1 | 70.8,53.97 C18.2 | L4.2 70.8,53.97
N$25
  Top 0.406: 73.88,52.71 75.25,52.71 | 75.25,52.71 X1.1 | 73.88,52.71 C18.1 | C19.1 73.03,52.71 73.88,52.71 | 75.25,52.71 R8.2
N$26
  Top 0.406: C23.1 C22.1 69,18.52 R9.2
N$27
  Top 0.406: 81.52,15.87 R11.E 81.6,19.37 80.64,20.32 73.76,20.32 C23.2
  pour Top: 78.78,17.42 83.41,17.42 83.41,14.39 78.64,14.39 78.69,17.34 78.78,17.34 78.78,17.36
N$28
  Top 0.406: R10.1 72.71,25.4 73.03,25.08 73.03,22.54 73.66,21.91 83.82,21.91 84.14,21.59 84.14,11.43 83.5,10.79 R11.S
  pour Top: 78.74,12.93 83.29,12.93 83.29,9.35 78.7,9.35 78.7,9.39 78.74,9.39 78.74,12.83
N$29
  Top 0.406: IC1.2 69.22,29.85 68.9,29.53 C25.1 | R10.2 C25.1 | T2.1 68.88,28.28 C25.1
N$30
  Top 0.406: IC1.7 C24.+
N$31
  Top 0.406: R14.1 R13.2 | C29.2 17.14,53.98 15.87,55.24 R13.2 | R13.2
N$32
  Top 0.305: C27.1 73.75,35.9 | 73.75,37.68 R12.1
  Top 0.61: 73.75,35.9 73.75,37.68
N$33
  Top 0.305: R12.2 74.14,39.95 74.19,40
  Top 0.406: 78.89,41.59 C28.+ 78.58,41.59 77.47,41.59 75.88,40 74.19,40 72.39,40 71.75,39.37 IC1.5
N$34
  Top 0.305: 84.1,32.05 X2.2 | 78.77,33.63 78.74,33.65
  Top 0.61: X2.3 75.29,33.48 75.44,33.63 78.77,33.63 83.88,33.63 84.1,33.41 84.1,32.05 | 78.74,33.65 C28.-
N$35
  Top 0.406: 10.79,55.88 R17.1 | 10.79,55.88 R14.2 | 10.79,55.88 10.96,55.71 T3.3 11.11,52.56 11.11,50.16 C30.2
N$36
  Top 0.406: T3.1 15.55,51.75 R15.1 17.46,51.44 17.78,51.12 R16.1
N$37
  Top 0.406: R15.2 C30.1
N$38
  Top 0.406: U$4.1 12.7,35.5 Q2.2 7.22,40.18 | C33.- 7.22,40.18 | C31.1 7.3,37.15 7.62,37.47 7.62,39.78 7.22,40.18
N$39
  Top 0.406: IC2.18 29.21,7.87 29.21,8.89 29.53,9.21 30.48,9.21 30.72,8.81 IC2.20 30.72,6.75 31.98,5.4 38.73,5.4 R19.2
N$40
  Top 0.305: C32.1 5.08,50.75 5.55,50.28 7.57,50.28 Q2.1
  Top 0.406: U$4.2 15.24,34.93 9.84,40.32 9.84,44.13 7.62,46.35 Q2.1
N$41
  Top 0.406: R18.2 C34.1
N$42
  Top 0.406: C34.2 43.5,51.12 44.13,50.48 U$1.3
N$43
  Top 0.406: U$4.11 25.4,39.37 26.04,38.74 31.75,38.74 33.97,40.96 33.97,50.8 35.88,52.71 R18.1
N$44
  Top 0.406: R13.1 18.73,54.93 18.73,53.34 19.05,53.02 20.21,53.02 D1.C | D1.C 20.32,50.9 C4.1 | D2.3 21.55,54.15 D1.C
N$45
  Top 0.406: R21.2 18.1,5.72 24.05,11.67 IC2.13 30.72,11.67 33.66,14.29 34.87,14.86 IC2.32
N$46
  Top 0.406: R20.1 18.41,8.57 22.31,12.47 IC2.12
N$47
  Top 0.406: X3.2 12.34,8.42 arc90 D6.C 15.04,8.78 R20.2 | R20.2 | R20.2 15.24,8.89 16.19,9.84 16.51,9.84 17.14,10.48 R22.2
N$48
  Top 0.406: X3.3 10.16,7.62 11.75,6.03 12.49,6.03 D5.C 15.13,5.83 R21.1
N$49
  Top 0.406: X4.2 26.99,5.08 24.77,7.3 24.77,9.53 25.4,10.16 26.73,10.16 IC2.15
N$50
  Top 0.406: X4.3 29.53,3.81 25.72,7.62 25.72,8.89 26.04,9.21 26.77,9.21 IC2.16
N$51
  Top 0.406: IC2.17 28.31,7.25 28.89,6.67 30.16,6.35 31.75,4.76 31.75,3.81 X4.4
N$52  (1 unrouted)
  Top 0.305: 41.76,8.24 41.96,8.24 42.14,8.42 43.71,8.42 43.81,8.31 43.79,5.46 43.88,5.45 | 34.61,1.79 X4.5 | C38.2 43.87,4.8 43.87,1.05 43.43,1.04 34.98,1.04 34.61,1.41 34.61,1.79 | R24.2 34.61,1.79
  Top 0.406: 41.76,8.24 34.93,8.25 33.97,9.21 33.97,12.07 34.29,12.38 35.33,12.38 IC2.29
N$53
  Top 0.406: R25.1 C44.1
N$54
  Top 0.406: IC2.10 31.53,14.07 arc40 33.02,14.61 arc-26 33.66,14.92 arc26 34.29,15.24 arc10 34.61,15.56 36.2,15.56 36.83,14.92 41.91,14.92 42.55,14.29 62.55,14.29 R25.2
N$55
  Top 0.406: IC2.11 19.44,13.26 R27.2 17.46,13.34 R26.1
N$56
  Top 0.305: C46.2 30.16,22.95 31.32,21.79 31.32,21.07 31.43,20.96
  Top 0.406: Q3.2 31.43,20.96 30.8,20.32 30.8,19.68 30.48,19.37 30.16,19.37 29.12,18.32 IC2.7
N$57
  Top 0.305: R28.1 56.46,2.51 55.52,1.57 47.71,1.57 47.55,1.74 47.55,3.42 X5.3
  Top 0.406: IC2.27 46.6,10.86 47.62,9.84 X5.3
N$58
  Top 0.406: IC2.28 48.34,11.67 50.17,9.84 X5.4
N$59
  Top 0.406: IC2.25 38.58,9.27 arc-90 LED1.C
N$60
  Top 0.305: IC2.24 33.91,7.36 33.93,7.62 38.6,7.62 LED2.C
N$61
  Top 0.406: LED1.A 44.13,9.21 44.77,8.57 44.77,6.99 R29.1
N$62
  Top 0.305: LED2.A 41.05,5.18 R30.1
N$63
  Top 0.305: 64.77,5.4 65.72,4.45 67.31,4.45 67.95,3.81 67.95,0.95 67.63,0.32 31.43,0.32 30.8,0.95 30.8,4.76 30.16,5.4 28.89,5.4 27.3,6.98 27.3,8.25 29.88,10.85 33.02,10.86 33.02,7.87 IC2.23
  Top 0.406: U$5.1 65.41,9.84 64.77,9.21 64.77,5.4
N$64
  Top 0.406: U$6.1 66.04,0.95 46.99,0.95 46.36,1.59 46.36,9.53 45.72,10.16 38.42,10.16 38.2,10.07 IC2.26
N$65
  Top 0.305: R31.2 65.02,30.62
  Top 0.406: 65.02,30.62 T2.3
N$66
  Top 0.305: R33.2 56.73,24.89
  Top 0.406: C35.1 R7.2 | C35.1 | C35.1 60.08,33.02 60.29,32.82 60.29,26.39 58.79,24.89 56.73,24.89
N$67
  Top 0.305: 46.41,24.73 R33.1
  Top 0.406: R32.2 41.85,16.76 42.82,17.74 42.82,22.71 44.84,24.73 46.41,24.73
N$68
  Top 0.305: 40.12,19.01 40.36,19.25 | 31.9,19.01 31.53,18.64 31.53,18.02 | 31.53,18.02 31.53,16.38 IC2.4 | IC2.6 29.91,17.68 30.25,18.02 31.53,18.02 | C37.2 24.22,28.96 24.27,29.01
  Top 0.406: 37.87,29.01 24.27,29.01 R34.2
  Top 0.61: 37.87,29.01 38.71,28.17 38.71,24.37 40.36,22.72 40.36,19.25 | 31.9,19.01 40.12,19.01
N$69
  pour Top: 58.55,47.8 58.67,47.8
N$70
  Top 0.305: 23.09,6.73 23.08,6.73
  Top 0.61: 23.09,3.67 23.09,6.73
RSSI
  Top 0.305: IC2.22 32.34,6.7 32.36,6.64 37.43,6.64 R32.1
RXD
  Top 0.406: IC2.30 36.58,13.26 37.47,12.38 56.2,12.38 58.1,10.48 X6.1
SQL
  Top 0.406: IC2.1 36.26,16.36 37.13,15.51 43.17,15.51 43.5,15.24 60.33,15.24 60.33,25.08 61.77,26.53 R31.1
TXD
  Top 0.406: IC2.31 38.96,14.07 39.69,13.33 56.83,13.33 60.64,9.53 X6.2
VCC  (via drill 0.5 pad 1.78, 0.5 pad 1.93)  (1 unrouted)
  Top 0.305: 53.35,18 53.36,18 | 64.43,43.16 C41.1 64.77,42.86 65.09,42.86 | C43.+ 36.05,33.52 | 11.11,44.45 C11.2
  Top 0.406: 58.1,42.86 U$1.19 53.66,42.55 | 58.1,42.86 U$3.P$2 65.09,42.86 66.36,41.59 66.36,36.19 67.31,35.24 69.85,35.24 70.48,35.88 IC1.6 70.48,39.37 72.07,40.96 73.03,40.96 73.34,41.28 73.34,42.55 C26.2 | 58.1,42.86 R6.2 | R5.2 C14.2 49.21,23.18 47.91,21.88 L2.2 50.65,18.88 52.46,18.88 53.35,18 | Q1.1 36.89,47.94 | 41.27,47.94 C13.1 | 20.32,36.83 U$4.13 | 26.84,48.58 T1.C 26.84,54.44 arc90 C39.1 | R17.2 | R17.2 7.3,53.66 9.53,53.66 9.53,46.04 11.11,44.45 11.11,40.32 14.6,36.83 | v26.35,48.58 26.84,48.58 | 26.84,48.58 R2.2 | 35.24,34.61 C43.+ | R17.2 C10.2 | 53.36,18 53.68,17.68 55.44,17.68 R28.2 | 64.43,43.16 C9.1
  Top 0.61: Q1.1 36.83,45.4 35.24,43.82 35.24,36.83 | 22.86,36.83 35.24,36.83 | 22.86,36.83 U$4.12 22.86,44.13 23.5,44.77 v26.35,44.77 | 14.6,36.83 20.32,36.83 22.86,36.83 | U$1.4 48.26,47.94 49.22,46.99 49.22,42.55 | 49.22,42.55 R5.2 | 49.22,42.55 53.66,42.55 | 35.24,36.83 35.24,34.61 | R23.1 35.75,30.82 36.05,31.13 36.05,33.52
  Top 0.813: 36.89,47.94 41.27,47.94 U$1.4